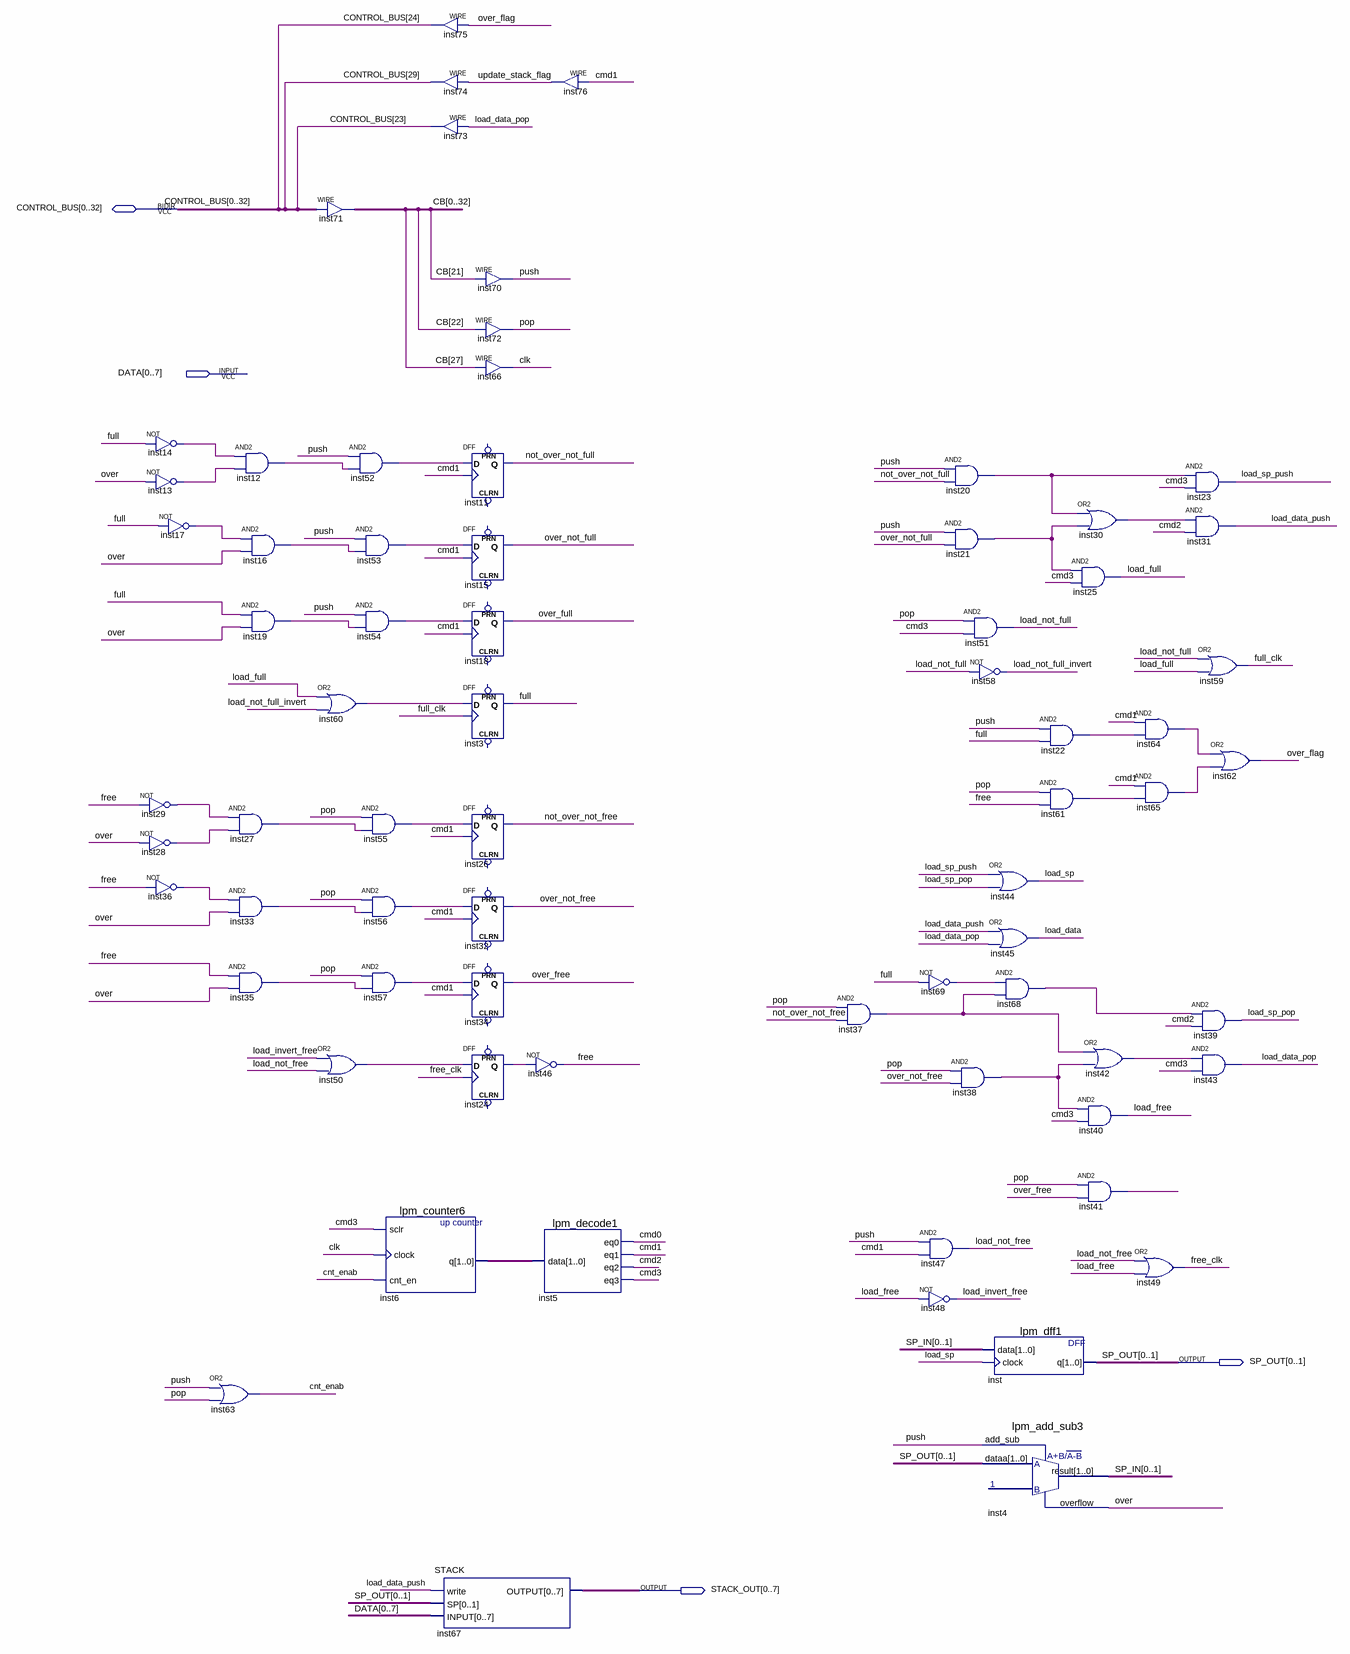
[diagram p0: schematic sheet]
// Quartus schematic STACK_CONTROLLER.bdf as structural Verilog: 71 symbols, 4 pins
module STACK_CONTROLLER (
  input  [0:7] DATA,
  inout  [0:32] CONTROL_BUS,
  output [0:1] SP_OUT,
  output [0:7] STACK_OUT
);

  wire clk, cmd0, cmd1, cmd2, cmd3, cnt_enab, free, free_clk, full, full_clk, inst12_out, inst13_out,
       inst14_out, inst16_out, inst17_out, inst19_out, inst20_out, inst21_out, inst22_out, inst24_q,
       inst27_out, inst28_out, inst29_out, inst30_out, inst33_out, inst35_out, inst36_out, inst37_out,
       inst38_out, inst41_out, inst42_out, inst50_out, inst52_out, inst53_out, inst54_out, inst55_out,
       inst56_out, inst57_out, inst60_out, inst61_out, inst64_out, inst65_out, inst68_out, inst69_out,
       load_data, load_data_pop, load_data_push, load_free, load_full, load_invert_free, load_not_free,
       load_not_full, load_not_full_invert, load_sp, load_sp_pop, load_sp_push, not_over_not_free,
       not_over_not_full, over, over_flag, over_free, over_full, over_not_free, over_not_full, pop, push,
       update_stack_flag;
  wire [1:0] inst6_q, SP_IN;
  wire [32:0] CB;

  not inst14 (inst14_out, full);
  not inst13 (inst13_out, over);
  not inst17 (inst17_out, full);
  not inst29 (inst29_out, free);
  not inst28 (inst28_out, over);
  not inst36 (inst36_out, free);
  or inst63 (cnt_enab, push, pop);
  and inst12 (inst12_out, inst14_out, inst13_out);
  and inst16 (inst16_out, inst17_out, over);
  and inst19 (inst19_out, full, over);
  and inst27 (inst27_out, inst29_out, inst28_out);
  and inst33 (inst33_out, inst36_out, over);
  and inst35 (inst35_out, free, over);
  assign {CB[0], CB[1], CB[2], CB[3], CB[4], CB[5], CB[6], CB[7], CB[8], CB[9], CB[10], CB[11], CB[12], CB[13], CB[14], CB[15], CB[16], CB[17], CB[18], CB[19], CB[20], CB[21], CB[22], CB[23], CB[24], CB[25], CB[26], CB[27], CB[28], CB[29], CB[30], CB[31], CB[32]} = CONTROL_BUS;  // WIRE inst71
  and inst52 (inst52_out, push, inst12_out);
  and inst53 (inst53_out, push, inst16_out);
  and inst54 (inst54_out, push, inst19_out);
  or inst60 (inst60_out, load_full, load_not_full_invert);
  and inst55 (inst55_out, pop, inst27_out);
  and inst56 (inst56_out, pop, inst33_out);
  and inst57 (inst57_out, pop, inst35_out);
  or inst50 (inst50_out, load_invert_free, load_not_free);
  lpm_counter6 inst6 (.sclr(cmd3), .clock(clk), .cnt_en(cnt_enab), .q(inst6_q));
  assign CONTROL_BUS[24] = over_flag;  // WIRE inst75
  assign CONTROL_BUS[29] = update_stack_flag;  // WIRE inst74
  assign CONTROL_BUS[23] = load_data_pop;  // WIRE inst73
  DFF inst11 (.CLK(cmd1), .D(inst52_out), .Q(not_over_not_full));  // open: CLRN, PRN
  DFF inst15 (.CLK(cmd1), .D(inst53_out), .Q(over_not_full));  // open: CLRN, PRN
  DFF inst18 (.CLK(cmd1), .D(inst54_out), .Q(over_full));  // open: CLRN, PRN
  DFF inst3 (.CLK(full_clk), .D(inst60_out), .Q(full));  // open: CLRN, PRN
  DFF inst26 (.CLK(cmd1), .D(inst55_out), .Q(not_over_not_free));  // open: CLRN, PRN
  DFF inst32 (.CLK(cmd1), .D(inst56_out), .Q(over_not_free));  // open: CLRN, PRN
  DFF inst34 (.CLK(cmd1), .D(inst57_out), .Q(over_free));  // open: CLRN, PRN
  DFF inst24 (.CLK(free_clk), .D(inst50_out), .Q(inst24_q));  // open: CLRN, PRN
  STACK inst67 (.write(load_data_push), .SP(SP_OUT), .INPUT(DATA), .OUTPUT(STACK_OUT));
  assign push = CB[21];  // WIRE inst70
  assign pop = CB[22];  // WIRE inst72
  assign clk = CB[27];  // WIRE inst66
  assign update_stack_flag = cmd1;  // WIRE inst76
  not inst46 (free, inst24_q);
  lpm_decode1 inst5 (.data(inst6_q), .eq0(cmd0), .eq1(cmd1), .eq2(cmd2), .eq3(cmd3));
  and inst37 (inst37_out, pop, not_over_not_free);
  not inst69 (inst69_out, full);
  and inst47 (load_not_free, push, cmd1);
  not inst48 (load_invert_free, load_free);
  and inst20 (inst20_out, push, not_over_not_full);
  and inst21 (inst21_out, push, over_not_full);
  and inst51 (load_not_full, pop, cmd3);
  not inst58 (load_not_full_invert, load_not_full);
  and inst38 (inst38_out, pop, over_not_free);
  or inst44 (load_sp, load_sp_push, load_sp_pop);
  or inst45 (load_data, load_data_push, load_data_pop);
  and inst68 (inst68_out, inst69_out, inst37_out);
  lpm_dff1 inst (.data({SP_IN[0], SP_IN[1]}), .clock(load_sp), .q(SP_OUT));
  lpm_add_sub3 inst4 (.dataa(SP_OUT), .add_sub(push), .result({SP_IN[0], SP_IN[1]}), .overflow(over));
  and inst25 (load_full, inst21_out, cmd3);
  and inst22 (inst22_out, push, full);
  and inst61 (inst61_out, pop, free);
  or inst30 (inst30_out, inst20_out, inst21_out);
  or inst42 (inst42_out, inst37_out, inst38_out);
  and inst40 (load_free, inst38_out, cmd3);
  and inst41 (inst41_out, pop, over_free);
  and inst64 (inst64_out, cmd1, inst22_out);
  and inst65 (inst65_out, cmd1, inst61_out);
  or inst49 (free_clk, load_not_free, load_free);
  and inst23 (load_sp_push, inst20_out, cmd3);
  and inst31 (load_data_push, inst30_out, cmd2);
  or inst59 (full_clk, load_not_full, load_full);
  or inst62 (over_flag, inst64_out, inst65_out);
  and inst39 (load_sp_pop, inst68_out, cmd2);
  and inst43 (load_data_pop, inst42_out, cmd3);
endmodule
